# EAGLE schematic 01 (EAGLE 7.2.0)
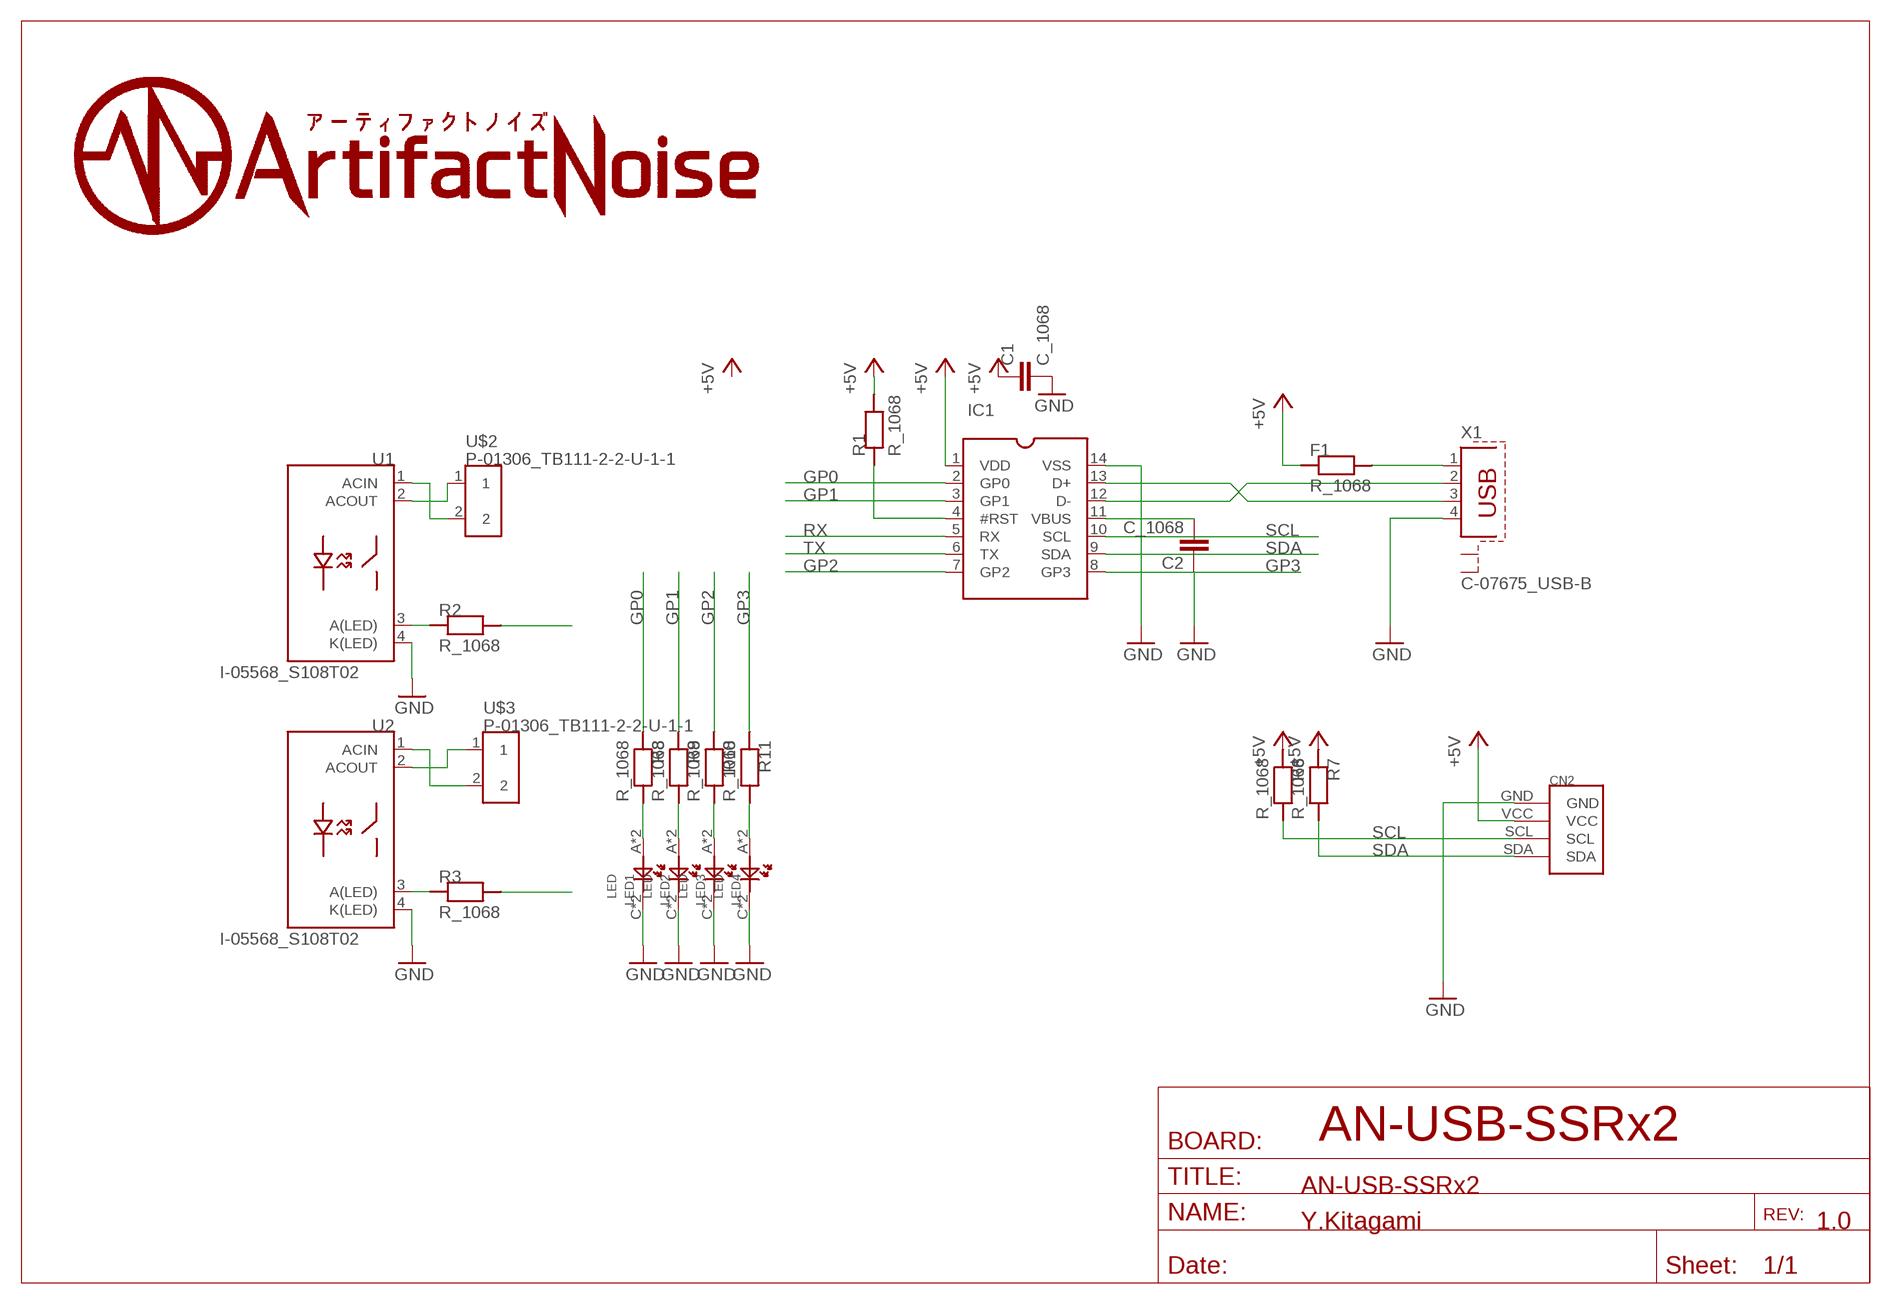
[diagram p0: schematic, sheet 1]

## Parts
C1  C_1068  [C0603]
C2  C_1068  [C0603]
CN2  PIN4  [PIN4]
F1  R_1068  [R0603]
IC1  _MCP2221A-I/PS  [SOCKET-14]
LED1  LED  [CHIPLED_0805]
LED2  LED  [CHIPLED_0805]
LED3  LED  [CHIPLED_0805]
LED4  LED  [CHIPLED_0805]
R1  R_1068  [R0603]
R2  R_1068  [R0603]
R3  R_1068  [R0603]
R6  R_1068  [R0603]
R7  R_1068  [R0603]
R8  R_1068  [R0603]
R9  R_1068  [R0603]
R10  R_1068  [R0603]
R11  R_1068  [R0603]
U1  I-05568_S108T02  [S108T02]
U2  I-05568_S108T02  [S108T02]
U$2  P-01306_TB111-2-2-U-1-1  [TB111-2-2-U-1-1]
U$3  P-01306_TB111-2-2-U-1-1  [TB111-2-2-U-1-1]
X1  C-07675_USB-B  [PN61729-S]

## Nets
+5V: C1.1 C1.D1 CN2.VCC F1.1 F1.D1 IC1.1(VDD) R1.2 R1.D2 R6.1 R6.D1 R7.1 R7.D1
GND: C1.2 C1.D2 C2.1 C2.D1 CN2.GND IC1.14(VSS) LED1.C LED1.DC(C) LED2.C LED2.DC(C) LED3.C LED3.DC(C) LED4.C LED4.DC(C) U1.4(K(LED)) U2.4(K(LED)) X1.4
GP0: IC1.2(GP0) R2.2 R2.D2 R8.1 R8.D1
GP1: IC1.3(GP1) R3.2 R3.D2 R9.1 R9.D1
GP2: IC1.7(GP2) R10.1 R10.D1
GP3: IC1.8(GP3) R11.1 R11.D1
N$1: IC1.4(#RST) R1.1 R1.D1
N$2: IC1.13(D+) X1.3
N$3: IC1.12(D-) X1.2
N$4: C2.2 C2.D2 IC1.11(VBUS)
N$5: F1.2 F1.D2 X1.1
N$6: R2.1 R2.D1 U1.3(A(LED))
N$7: R3.1 R3.D1 U2.3(A(LED))
N$8: U1.1(ACIN) U$2.2
N$9: LED1.A LED1.DA(A) R8.2 R8.D2
N$10: LED2.A LED2.DA(A) R9.2 R9.D2
N$11: LED3.A LED3.DA(A) R10.2 R10.D2
N$12: LED4.A LED4.DA(A) R11.2 R11.D2
N$13: U1.2(ACOUT) U$2.1
N$14: U2.1(ACIN) U$3.2
N$15: U2.2(ACOUT) U$3.1
RX: IC1.5(RX)
SCL: CN2.SCL IC1.10(SCL) R6.2 R6.D2
SDA: CN2.SDA IC1.9(SDA) R7.2 R7.D2
TX: IC1.6(TX)
Unconnected: X1.S1 X1.S2

## Notes on the sheet
- AN-USB-SSRx2
- AN-USB-SSRx2
- Y.Kitagami | 1.0

## Library data of the parts
C1 C2 = 01:C_1068
CN2 = 01:PIN4
F1 R1-R3 R6-R11 = 01:R_1068
IC1 = 01:_MCP2221A-I/P: Dual In Line / Socket
LED1-LED4 = 01:LED
U1 U2 = 01:I-05568_S108T02
U$2 U$3 = 01:P-01306_TB111-2-2-U-1-1
X1 = 01:C-07675_USB-B: BERG USB connector; OC_FARNELL: unknown; OC_NEWARK: unknown